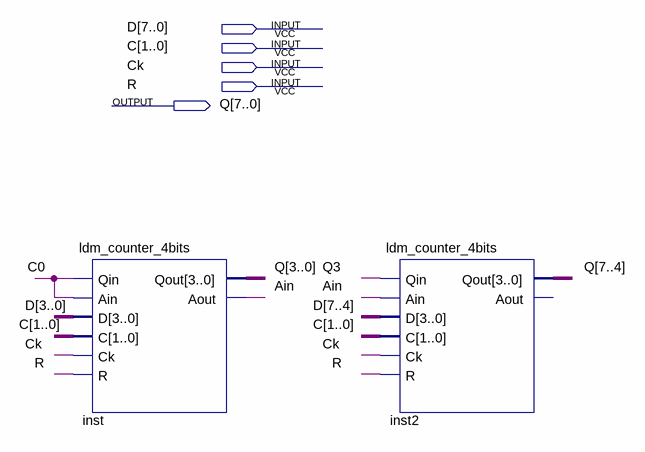
[diagram p0: schematic sheet]
// Quartus schematic ldm_counter_8bits.bdf as structural Verilog: 2 symbols, 5 pins
module ldm_counter_8bits (
  input  [7:0] D,
  input  [1:0] C,
  input  Ck,
  input  R,
  output [7:0] Q
);

  wire Ain;

  ldm_counter_4bits inst (.Qin(C[0]), .Ain(C[0]), .D(D[3:0]), .C(C), .Ck(Ck), .R(R), .Qout(Q[3:0]), .Aout(Ain));
  ldm_counter_4bits inst2 (.Qin(Q[3]), .Ain(Ain), .D(D[7:4]), .C(C), .Ck(Ck), .R(R), .Qout(Q[7:4]));  // open: Aout
endmodule
